# Altium project IDC_HD68_Adapter.PrjPCB
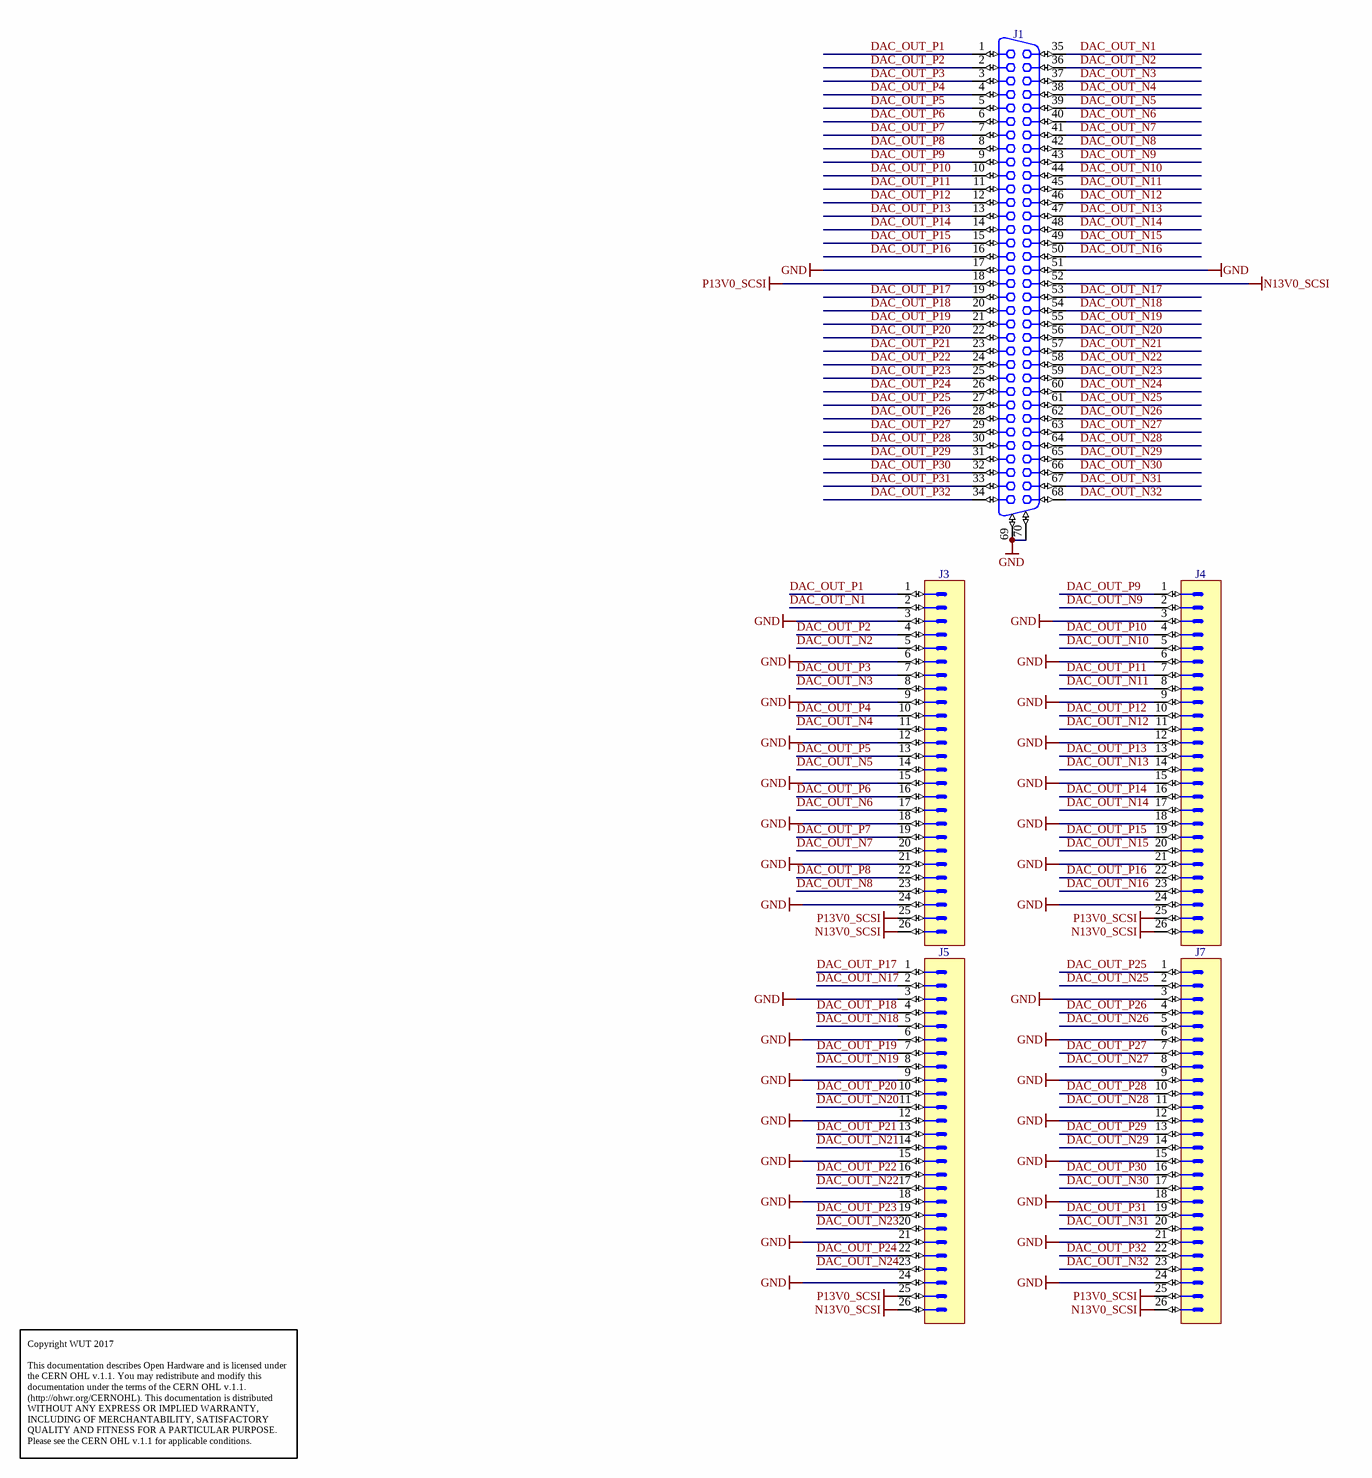
[diagram p0: IDC_HD68_Adapter.SchDoc]
1 sheet, 5 parts. Net scope: global (net labels, ports and power ports of the same name join across sheets).
Board files: IDC_HD68_Adapter.PCBDOC, Panel_HD68_Adapter.PcbDoc

## Sheet IDC_HD68_Adapter.SchDoc: IDC to HD68
size 420 x 297 mm; Author: G.K.; CompanyName: WUT; DrawnBy: G.K.; Organization: WUT ISE; Address1: Warsaw Univeristy of Technology; Address2: Nowowiejska 15/19; DocumentNumber: 3; Revision: -; SheetNumber: 3; SheetTotal: 7; EDA_Number: ARTIQ; Projet: ARTIQ/SINARA; ModifiedBy: -; CreateDate: XX/XX/XXXX; CheckedDate: -; Title2: adapter v1.0; DivGrp: ISE; Designer: G.K.; ModifiedDate: -; ProjectName: IDC to HD68 adapter

### Parts
J1  D-SUB  [TYCO_5787082-7]  (value not drawn)
J3  Header 26  [3M_N2526-6002RB]  (value not drawn)
J4  Header 26  [3M_N2526-6002RB]  (value not drawn)
J5  Header 26  [3M_N2526-6002RB]  (value not drawn)
J7  Header 26  [3M_N2526-6002RB]  (value not drawn)

### Nets
GND: J1.17 J1.51 J1.69 J1.70 J3.3 J3.6 J3.9 J3.12 J3.15 J3.18 J3.21 J3.24 J4.3 J4.6 J4.9 J4.12 J4.15 J4.18 J4.21 J4.24 J5.3 J5.6 J5.9 J5.12 J5.15 J5.18 J5.21 J5.24 J7.3 J7.6 J7.9 J7.12 J7.15 J7.18 J7.21 J7.24
N13V0_SCSI: J1.52 J3.26 J4.26 J5.26 J7.26
P13V0_SCSI: J1.18 J3.25 J4.25 J5.25 J7.25
DAC_OUT_N1: J1.35 J3.2
DAC_OUT_N2: J1.36 J3.5
DAC_OUT_N3: J1.37 J3.8
DAC_OUT_N4: J1.38 J3.11
DAC_OUT_N5: J1.39 J3.14
DAC_OUT_N6: J1.40 J3.17
DAC_OUT_N7: J1.41 J3.20
DAC_OUT_N8: J1.42 J3.23
DAC_OUT_N9: J1.43 J4.2
DAC_OUT_N10: J1.44 J4.5
DAC_OUT_N11: J1.45 J4.8
DAC_OUT_N12: J1.46 J4.11
DAC_OUT_N13: J1.47 J4.14
DAC_OUT_N14: J1.48 J4.17
DAC_OUT_N15: J1.49 J4.20
DAC_OUT_N16: J1.50 J4.23
DAC_OUT_N17: J1.53 J5.2
DAC_OUT_N18: J1.54 J5.5
DAC_OUT_N19: J1.55 J5.8
DAC_OUT_N20: J1.56 J5.11
DAC_OUT_N21: J1.57 J5.14
DAC_OUT_N22: J1.58 J5.17
DAC_OUT_N23: J1.59 J5.20
DAC_OUT_N24: J1.60 J5.23
DAC_OUT_N25: J1.61 J7.2
DAC_OUT_N26: J1.62 J7.5
DAC_OUT_N27: J1.63 J7.8
DAC_OUT_N28: J1.64 J7.11
DAC_OUT_N29: J1.65 J7.14
DAC_OUT_N30: J1.66 J7.17
DAC_OUT_N31: J1.67 J7.20
DAC_OUT_N32: J1.68 J7.23
DAC_OUT_P1: J1.1 J3.1
DAC_OUT_P2: J1.2 J3.4
DAC_OUT_P3: J1.3 J3.7
DAC_OUT_P4: J1.4 J3.10
DAC_OUT_P5: J1.5 J3.13
DAC_OUT_P6: J1.6 J3.16
DAC_OUT_P7: J1.7 J3.19
DAC_OUT_P8: J1.8 J3.22
DAC_OUT_P9: J1.9 J4.1
DAC_OUT_P10: J1.10 J4.4
DAC_OUT_P11: J1.11 J4.7
DAC_OUT_P12: J1.12 J4.10
DAC_OUT_P13: J1.13 J4.13
DAC_OUT_P14: J1.14 J4.16
DAC_OUT_P15: J1.15 J4.19
DAC_OUT_P16: J1.16 J4.22
DAC_OUT_P17: J1.19 J5.1
DAC_OUT_P18: J1.20 J5.4
DAC_OUT_P19: J1.21 J5.7
DAC_OUT_P20: J1.22 J5.10
DAC_OUT_P21: J1.23 J5.13
DAC_OUT_P22: J1.24 J5.16
DAC_OUT_P23: J1.25 J5.19
DAC_OUT_P24: J1.26 J5.22
DAC_OUT_P25: J1.27 J7.1
DAC_OUT_P26: J1.28 J7.4
DAC_OUT_P27: J1.29 J7.7
DAC_OUT_P28: J1.30 J7.10
DAC_OUT_P29: J1.31 J7.13
DAC_OUT_P30: J1.32 J7.16
DAC_OUT_P31: J1.33 J7.19
DAC_OUT_P32: J1.34 J7.22

### Notes on the sheet
- Copyright WUT 2017
  This documentation describes Open Hardware and is licensed under the CERN OHL v.1.1. You may redistribute and modify this documentation under the terms of the CERN OHL v.1.1. (http://ohwr.org/CERNOHL). This documentation is distributed WITHOUT ANY EXPRESS OR IMPLIED WARRANTY, INCLUDING OF MERCHANTABILITY, SATISFACTORY QUALITY AND FITNESS FOR A PARTICULAR PURPOSE. Please see the CERN OHL v.1.1 for applicable conditions.
- Project/Equipment
- Document
- Designer
- Drawn by
- Check.by
- File
- Last Mod.
- Print Date
- Sheet
- Size
- A3
- of
- Rev

### Library data of the parts
J1 = TYCO_5787082-7: 68 contacts, AMPLIMITE .050", Right Angled Receptacle Series III; Manufacturer: TYCO ELECTRONICS; PressFit: No; Part Number: TYCO_5787082-7; Component Kind: Standard; Component Type: Standard; Pin Count: 70; Family: D-SUB; Mounted: Yes; Socket: No; SMD: No; Sense: No; Status: None; Part Description: 68 contacts, AMPLIMITE .050", Right Angled Receptacle Series III; Manufacturer Part Number: 5787082-7; ComponentHeight: 9.5mm; HelpURL: \\cern.ch\dfs\Applications\Altium\Datasheets\TYCO_5787082-7.pdf; Author: CERN DEM JLC; CreateDate: 13.03.2017; LatestRevisionDate: 13.03.2017
J3-J5 J7 = 3M_N2526-6002RB: Connector 26 Male; Part Description: 26 Contacts - Straight .100'' x .100'' Low Profile Four-Wall Header, 2500 Series; Manufacturer: 3M; PressFit: No; Part Number: 3M_N2526-6002RB; Component Kind: Standard; Component Type: Standard; Pin Count: 26; Family: Header 26; Mounted: Yes; Socket: No; SMD: No; Sense: No; Status: None; Manufacturer Part Number: N2526-6002RB; ComponentHeight: 10.03mm; HelpURL: \\cern.ch\dfs\Applications\Altium\Datasheets\3M_N2526-6002RB.pdf; Author: CERN DEM JLC; CreateDate: 11.02.2009; LatestRevisionDate: 11.08.2009